# Altium schematic sheet Sheet3.SchDoc
size A; SheetNumber: 2; SheetTotal: 4
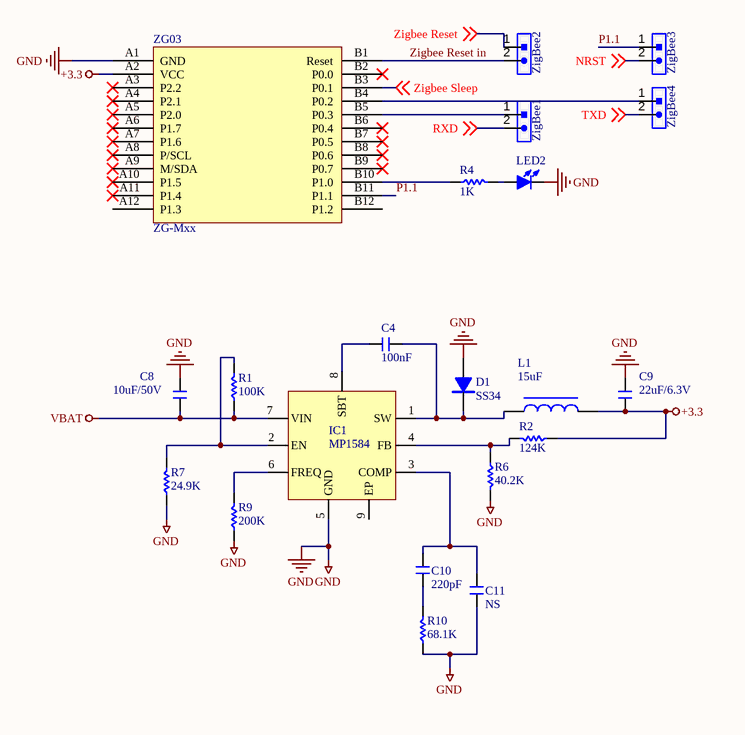
[diagram p0: Sheet3.SchDoc]

## Parts
C4  100nF  [C 0402]
C8  10uF/50V  [C 1206]
C9  22uF/6.3V  [C 1206]
C10  220pF  [C 0402]
C11  NS  [C 0402]
D1  SS34  [SMA]
IC1  MP1584  [SOP8_N-EP]
L1  15uF  [WHC0630]
LED2  LED-SMD  [LED 0805B]  (value not drawn)
R1  100K  [R 0402-HP]
R2  124K  [R 0402-HP]
R4  1K  [R 0805]
R6  40.2K  [R 0402-HP]
R7  24.9K  [R 0402-HP]
R9  200K  [R 0402-HP]
R10  68.1K  [R 0402-HP]
ZG03  ZG-Mxx  [XBee]
ZigBee1  HDR-1X2  [HDR-1X2]  (value not drawn)
ZigBee2  HDR-1X2  [HDR-1X2]  (value not drawn)
ZigBee3  HDR-1X2  [HDR-1X2]  (value not drawn)
ZigBee4  HDR-1X2  [HDR-1X2]  (value not drawn)

## Nets
+3.3: C9.1 L1.2 R2.1 ZG03.A2(VCC)
GND: C8.2 C9.2 C11.1 D1.1(A) IC1.5(GND) LED2.2(K) R6.2 R7.1 R9.1 R10.1 ZG03.A1(GND)
VBAT: C8.1 IC1.7(VIN) R1.1
NRST: ZigBee3.2 ; off-sheet NRST
P1.1: ZG03.B11(P1.1) ZigBee3.1
RXD: ZigBee1.2 ; off-sheet RXD
TXD: ZigBee4.2 ; off-sheet TXD
Zigbee Reset: ZigBee2.1 ; off-sheet Zigbee Reset
Zigbee Reset in: ZG03.B1(Reset) ZigBee2.2
Zigbee Sleep: ZG03.B3(P0.1) ; off-sheet Zigbee Sleep
NetC4_1: C4.1 IC1.8(SBT)
NetC4_2: C4.2 D1.2(K) IC1.1(SW) L1.1
NetC10_1: C10.1 R10.2
NetC10_2: C10.2 C11.2 IC1.3(COMP)
NetIC1_2: IC1.2(EN) R1.2 R7.2
NetIC1_4: IC1.4(FB) R2.2 R6.1
NetIC1_6: IC1.6(FREQ) R9.2
NetLED2_1: LED2.1(A) R4.2
NetR4_1: R4.1 ZG03.B10(P1.0)
NetZG03_B4: ZG03.B4(P0.2) ZigBee4.1
NetZG03_B5: ZG03.B5(P0.3) ZigBee1.1

Not connected (* = marked no-connect by the designer): IC1 9(EP); ZG03 A3(P2.2)* A4(P2.1)* A5(P2.0)* A6(P1.7)* A7(P1.6)* A8(P/SCL)* A9(M/SDA)* A10(P1.5)* A11(P1.4)* A12(P1.3) B2(P0.0)* B6(P0.4)* B7(P0.5)* B8(P0.6)* B9(P0.7)* B12(P1.2)

## Library data of the parts
C4 C8-C11 = C: Non-polar patch capacitor; BOM名称: 无极性贴片电容; 版权归属: 源创客; 学习资源: www.ooocke.com
D1 = SS34: Schottky diodes; BOM名称: 肖特基二极管; 版权归属: 源创客; 属性: 40V/3A; 学习资源: www.ooocke.com
IC1 = MP1584: DC step-down chip
L1 = L-WHC: One-piece high current inductor
LED2 = LED-SMD: Patch LED; BOM名称: 贴片LED; 版权归属: 源创客; 学习资源: www.ooocke.com
R1 R2 R4 R6 R7 R9 R10 = R: Chip resistor; 版权归属: 源创客; BOM名称: Chip resistor; 学习资源: www.ooocke.com
ZG03 = XBee
ZigBee1-ZigBee4 = Header 2: 2P Connector; BOM名称: 2P接插件; 版权归属: 源创客; 学习资源: www.ooocke.com